# Altium schematic sheet 05) SPI ADC AND SWIZZLE.SchDoc
size 447 x 332 mm
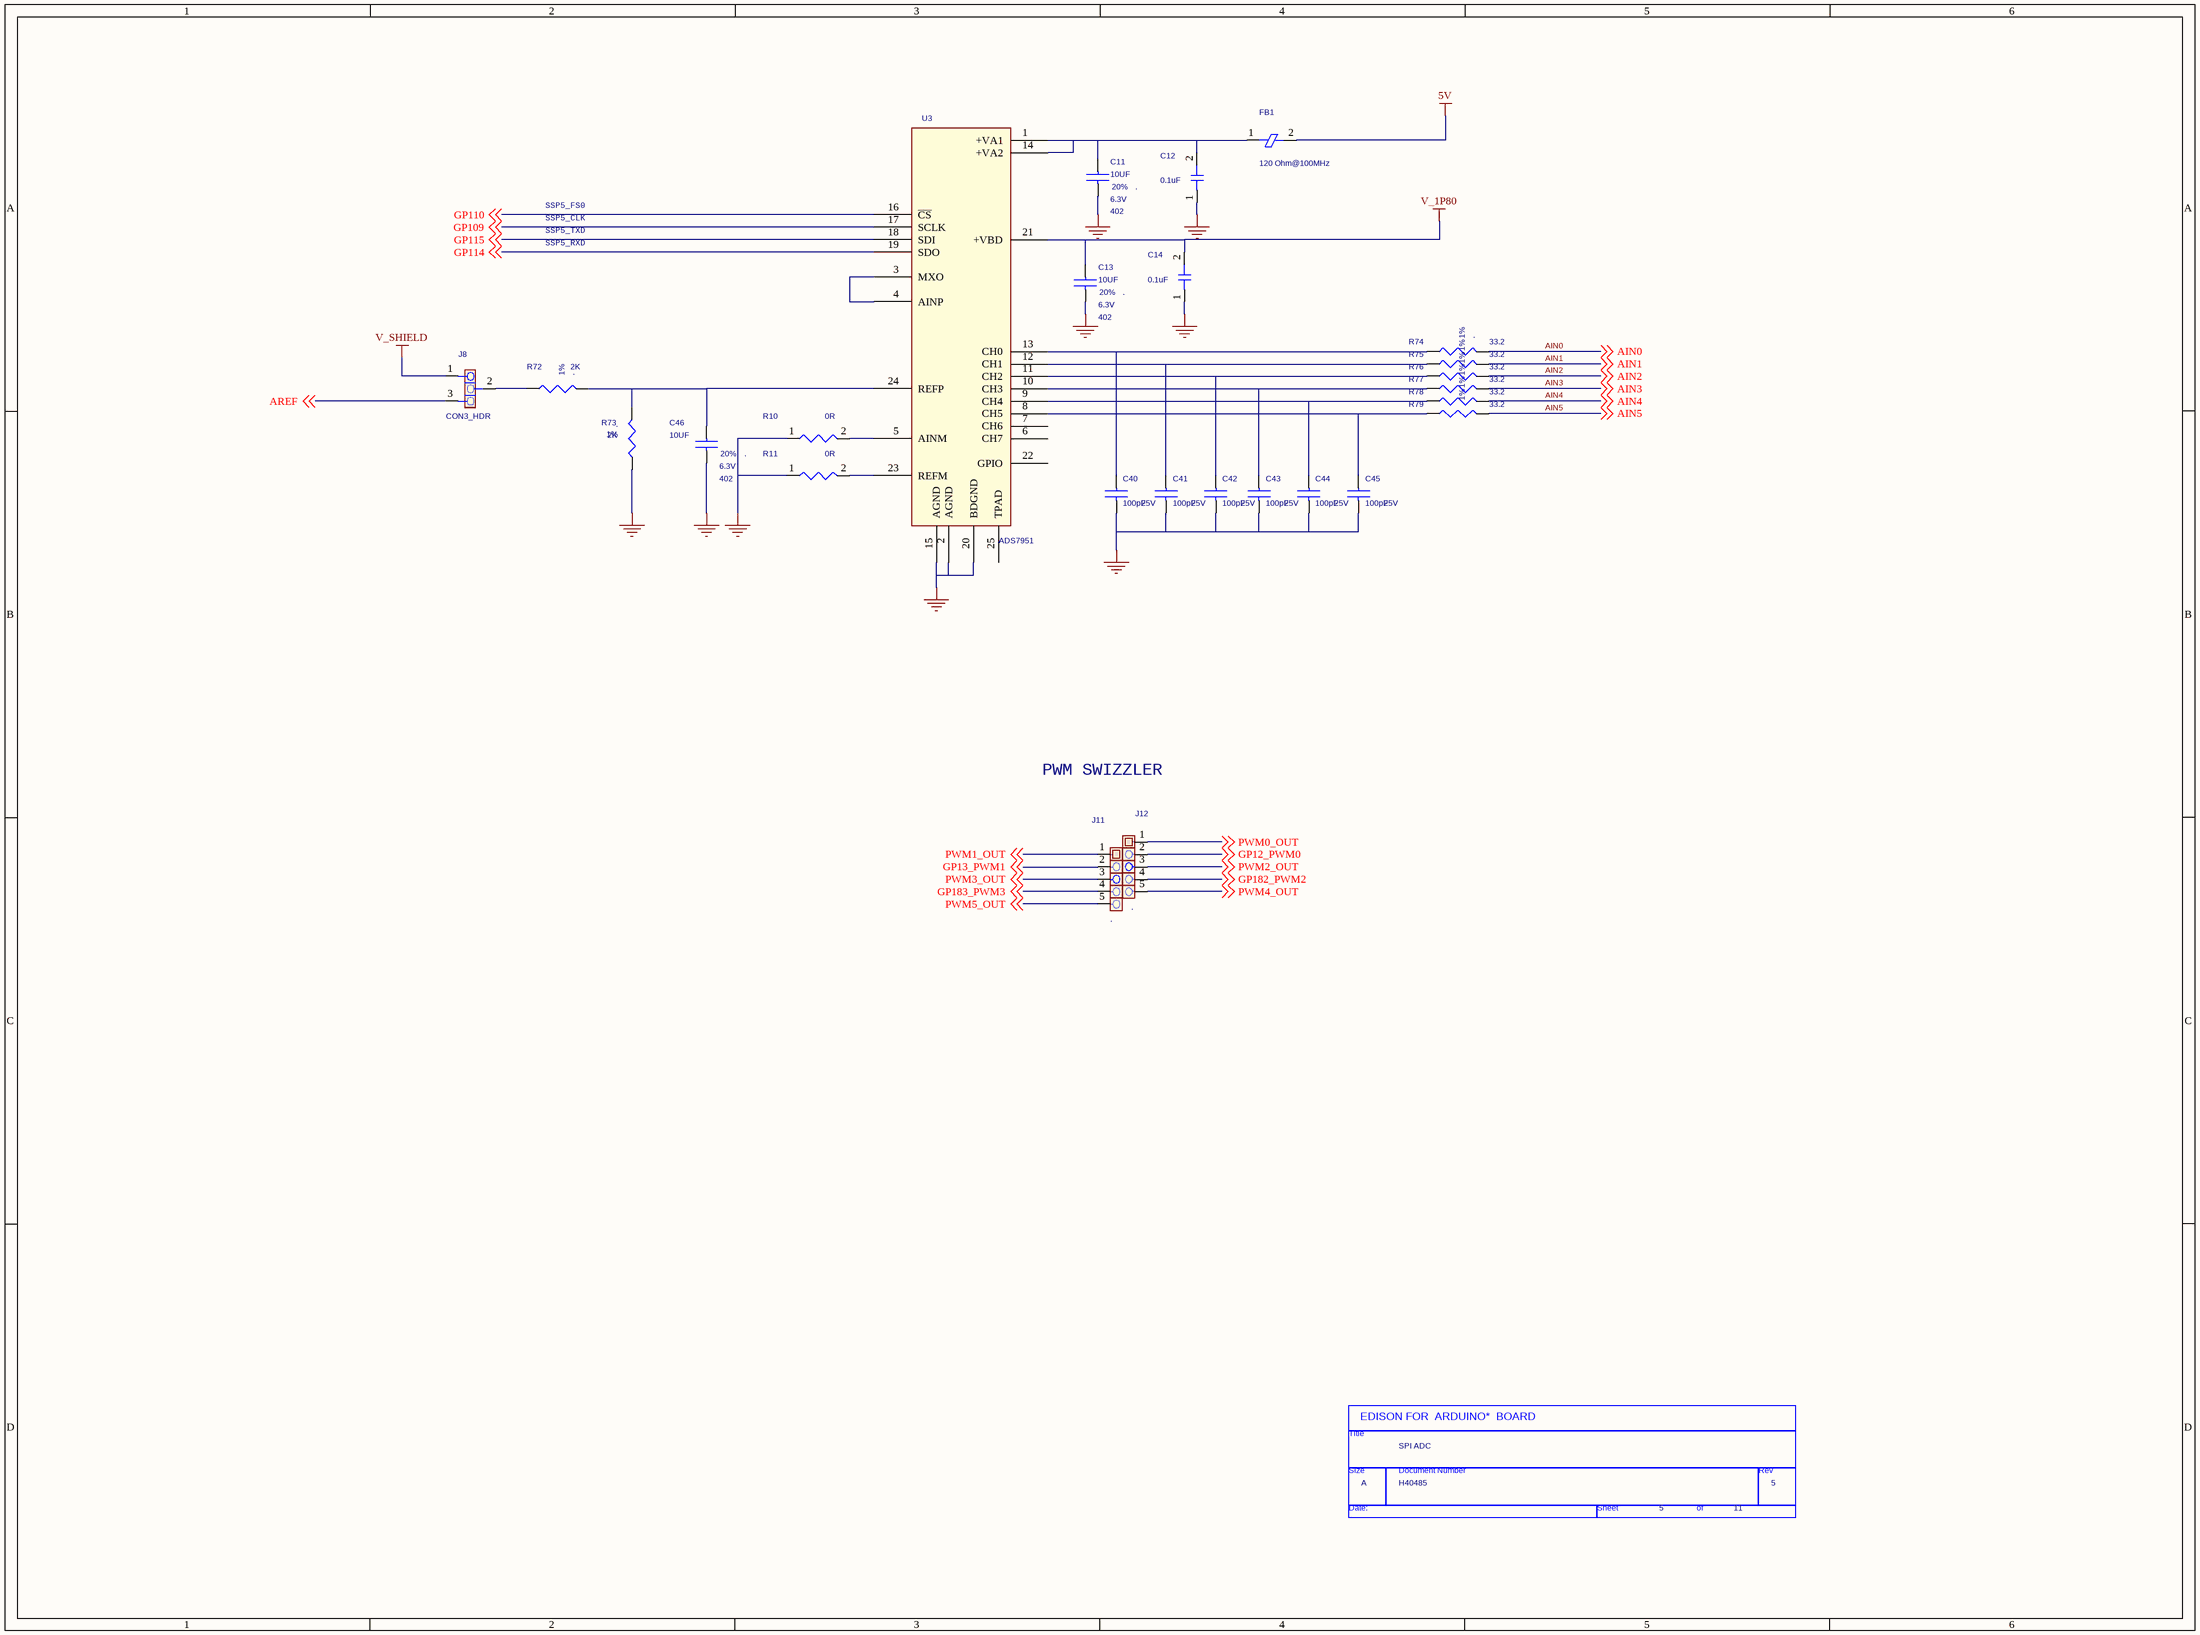
[diagram p0: 05) SPI ADC AND SWIZZLE.SchDoc]

## Parts
*  Page Count: 11  Page Number: 5  Page Size: A  Title: SPI ADC  Doc: H40485  (hidden comment: TitleBlock0)  (graphical)
C11  10UF  SIZE: 402  NO_STUFF: .  TOL: 20%  RATING: 6.3V  [SMC0402]
C12  0.1uF  [C0201]
C13  10UF  SIZE: 402  NO_STUFF: .  TOL: 20%  RATING: 6.3V  [SMC0402]
C14  0.1uF  [C0201]
C40  100pF  RATING: 25V  [SMC0201]
C41  100pF  RATING: 25V  [SMC0201]
C42  100pF  RATING: 25V  [SMC0201]
C43  100pF  RATING: 25V  [SMC0201]
C44  100pF  RATING: 25V  [SMC0201]
C45  100pF  RATING: 25V  [SMC0201]
C46  10UF  SIZE: 402  NO_STUFF: .  TOL: 20%  RATING: 6.3V  [SMC0402]
FB1  120 Ohm@100MHz  [SMF0402]
J8  CON3_HDR  [1x3hdr_p100in_th]
J11  NO_STUFF: .  [102276-005]  (hidden comment: 1X5_HDR)
J12  NO_STUFF: .  [102276-005]  (hidden comment: 1X5_HDR)
R10  0R  [0603.PRT]
R11  0R  [0603.PRT]
R72  2K  TOL: 1%  NO_STUFF: .  [SMR0201]
R73  2K  TOL: 1%  NO_STUFF: .  [SMR0201]
R74  33.2  NO_STUFF: .  TOL: 1%  [SMR0201]
R75  33.2  NO_STUFF: .  TOL: 1%  [SMR0201]
R76  33.2  NO_STUFF: .  TOL: 1%  [SMR0201]
R77  33.2  NO_STUFF: .  TOL: 1%  [SMR0201]
R78  33.2  NO_STUFF: .  TOL: 1%  [SMR0201]
R79  33.2  NO_STUFF: .  TOL: 1%  [SMR0201]
U3  ADS7951  [QFN24P_5M_4X4M]

## Nets
5V: FB1.2(FB2)
GND: C11.2 C12.1(END1) C13.2 C14.1(END1) C40.2 C41.2 C42.2 C43.2 C44.2 C45.2 C46.2 R10.1 R11.1 R73.1 U3.2(AGND) U3.15(AGND) U3.20(BDGND)
V_1P80: C13.1 C14.2(END2) U3.21(+VBD)
V_SHIELD: J8.1
AIN0: R74.2 ; off-sheet AIN0
AIN1: R75.2 ; off-sheet AIN1
AIN2: R76.2 ; off-sheet AIN2
AIN3: R77.2 ; off-sheet AIN3
AIN4: R78.2 ; off-sheet AIN4
AIN5: R79.2 ; off-sheet AIN5
AREF: J8.3 ; off-sheet AREF
GP12_PWM0: J12.2 ; off-sheet GP12_PWM0
GP13_PWM1: J11.2 ; off-sheet GP13_PWM1
GP109: U3.17(SCLK) ; off-sheet GP109
GP110: U3.16(~{CS}) ; off-sheet GP110
GP114: U3.19(SDO) ; off-sheet GP114
GP115: U3.18(SDI) ; off-sheet GP115
GP182_PWM2: J12.4 ; off-sheet GP182_PWM2
GP183_PWM3: J11.4 ; off-sheet GP183_PWM3
PWM0_OUT: J12.1 ; off-sheet PWM0_OUT
PWM1_OUT: J11.1 ; off-sheet PWM1_OUT
PWM2_OUT: J12.3 ; off-sheet PWM2_OUT
PWM3_OUT: J11.3 ; off-sheet PWM3_OUT
PWM4_OUT: J12.5 ; off-sheet PWM4_OUT
PWM5_OUT: J11.5 ; off-sheet PWM5_OUT
NetC11_1: C11.1 C12.2(END2) FB1.1(FB1) U3.1(+VA1) U3.14(+VA2)
NetC40_1: C40.1 R74.1 U3.13(CH0)
NetC41_1: C41.1 R75.1 U3.12(CH1)
NetC42_1: C42.1 R76.1 U3.11(CH2)
NetC43_1: C43.1 R77.1 U3.10(CH3)
NetC44_1: C44.1 R78.1 U3.9(CH4)
NetC45_1: C45.1 R79.1 U3.8(CH5)
NetC46_1: C46.1 R72.2 R73.2 U3.24(REFP)
NetJ8_2: J8.2 R72.1
NetR10_2: R10.2 U3.5(AINM)
NetR11_2: R11.2 U3.23(REFM)
NetU3_3: U3.3(MXO) U3.4(AINP)

Not connected (* = marked no-connect by the designer): U3 6(CH7) 7(CH6) 22(GPIO) 25(TPAD)

## Notes on the sheet
- SSP5_FS0
- SSP5_CLK
- SSP5_TXD
- SSP5_RXD
- PWM SWIZZLER
- (in symbol TitleBlock0) EDISON FOR  ARDUINO*  BOARD; Title; Size; Document Number; Rev; Date:; Sheet; of

## Library data of the parts
C11 C13 C46 = CAPC,X5R,0402,6.3V,20%,10uF: CAP C,10UF,0402,X5R,6.3V,+/-20%,; PART_NUMBER: A36096-114; Device: G21049-001; LEAD_FREE: YES; BOM: x; IPN: G21049-001; FINANCE: x
C12 C14 = CAP: CAPC,X5R,0201,0.1UF,10.00V,+/- 10%; Manufacturer: GENERIC; PART_NUMBER: C83410-014; OriginalSymbolOrigin: (-50,50); Code: 27; Process: SMD; VOLTAGE: ?; PERC: ?; PATH: ?
C40-C45 = CAPC,COG,0201,25V,5%,100pF: CAPC,C0G,0201,100.000PF,25.000V,+/- 5%; PART_NUMBER: D70542-001; NO_STUFF: .; LEAD_FREE: YES; BOM: x; ROOM: BATTERY; IPN: D70542-001; Device: D70542-001; FINANCE: x
FB1 = FERBD,0402,120Ohm_100MHz,1.3A: FER-BEAD,0402,120.0 OHM,1.3 A,± 25%; PART_NUMBER: A51464-017; FINANCE: x; LEAD_FREE: YES; ROOM: AUDIO_SPKR; NO_STUFF: .; BOM: x; IPN: A51464-017; Device: A51464-017
J8 = CON3,HDR,TH,0.1in,A91829-009: CONN,HDR,1 X 3,PLG,VT,0.1,062ST,KP; IPN: A91829-001; LEAD_FREE: YES; NO_STUFF: .; Device: A91829-001; BOM: x; FINANCE: x; PART_NUMBER: A91829-001
J11 J12 = CON5,HDR,TH,100mil,A91829-006: CONN,HDR,1 X 5,PLG,VT,0.1,093ST,KP 0.23>; PART_NUMBER: C88650-001; LEAD_FREE: YES; FINANCE: x; BOM: x; IPN: C88650-001; Device: C88650-001
R10 R11 = R_0: RES_D,0201,0.00OHM,1/20W; PART_NUMBER: C80792-009; Manufacturer: Yageo
R72 R73 = RESD,0201,1%,1/20W,2K: RES D,0201,2.00 kOHM,1.00%,1/20W,YES; PART_NUMBER: C48657-013; FINANCE: x; ROOM: APE_PMIC_MISC; BOM: x; LEAD_FREE: YES; IPN: C48657-013; RATING: 1/20W; Device: C48657-013
R74-R79 = RESD,0201,1%,1/20W,33.2: RES D,0201,33.2OHM,1.00%,1/20W,YES; Device: C48657-043; BOM: x; RATING: 1/20W; IPN: C48657-043; PART_NUMBER: C48657-043; LEAD_FREE: YES; FINANCE: x
U3 = ads7959_0: IC, LIN,VFQFPN,ADS7828E,ADC; PART_NUMBER: H40908-001; MFG PN: ADS7955SRGET
* = TitleBlock0: RevCode: 5; Page Create Date: March  8, 1995